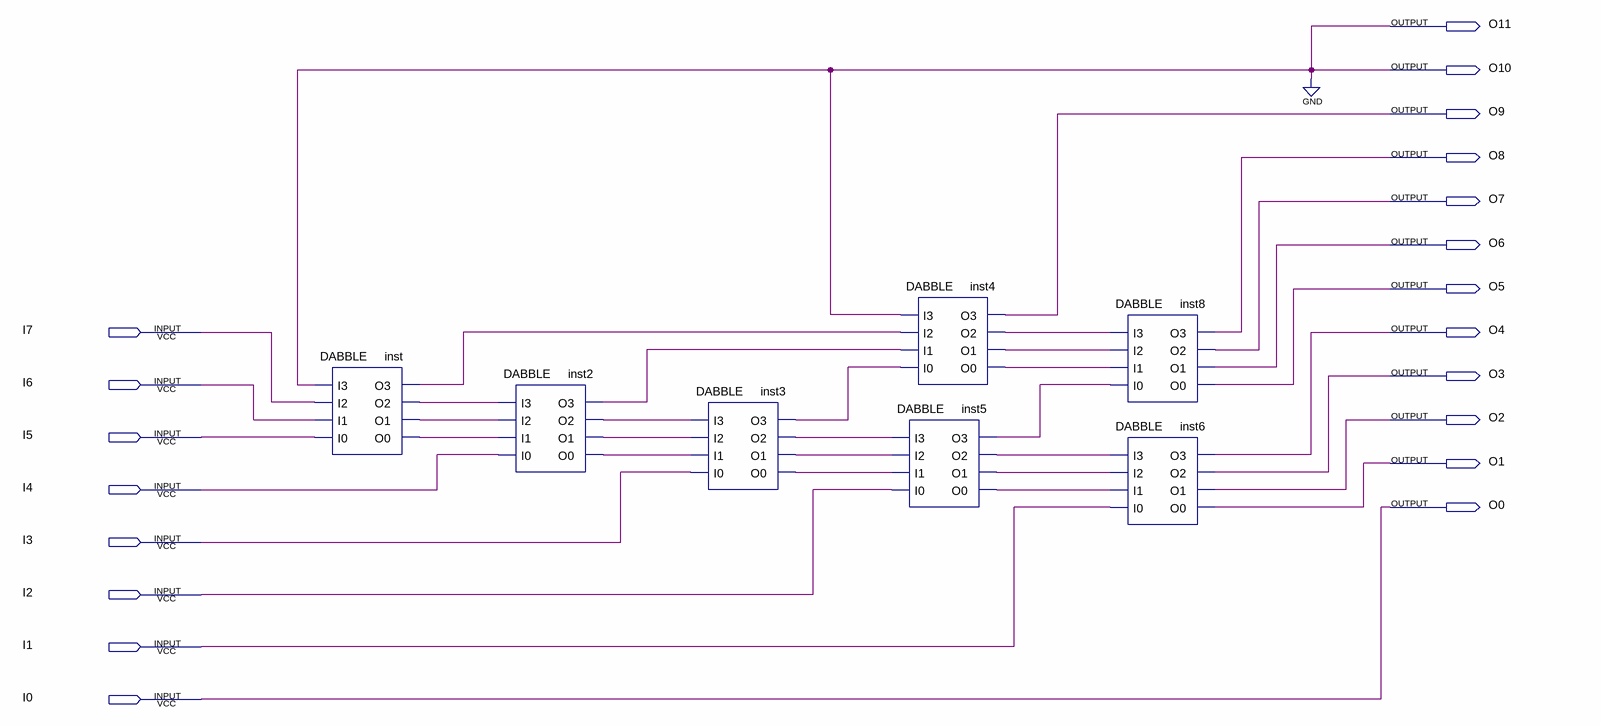
[diagram p0: schematic sheet]
// Quartus schematic DOUBLE_DABBLE.bdf as structural Verilog: 7 symbols, 20 pins
module DOUBLE_DABBLE (
  input  I7,
  input  I6,
  input  I5,
  input  I4,
  input  I3,
  input  I2,
  input  I1,
  input  I0,
  output O11,
  output O10,
  output O9,
  output O8,
  output O7,
  output O6,
  output O5,
  output O4,
  output O3,
  output O2,
  output O1,
  output O0
);

  wire inst2_o0, inst2_o1, inst2_o2, inst2_o3, inst3_o0, inst3_o1, inst3_o2, inst3_o3, inst4_o0, inst4_o1,
       inst4_o2, inst5_o0, inst5_o1, inst5_o2, inst5_o3, inst_o0, inst_o1, inst_o2, inst_o3;

  DABBLE inst (.I3(1'b0), .I2(I7), .I1(I6), .I0(I5), .O3(inst_o3), .O2(inst_o2), .O1(inst_o1), .O0(inst_o0));
  DABBLE inst2 (
    .I3(inst_o2), .I2(inst_o1), .I1(inst_o0), .I0(I4), .O3(inst2_o3), .O2(inst2_o2), .O1(inst2_o1),
    .O0(inst2_o0));
  DABBLE inst3 (
    .I3(inst2_o2), .I2(inst2_o1), .I1(inst2_o0), .I0(I3), .O3(inst3_o3), .O2(inst3_o2), .O1(inst3_o1),
    .O0(inst3_o0));
  DABBLE inst4 (
    .I3(1'b0), .I2(inst_o3), .I1(inst2_o3), .I0(inst3_o3), .O3(O9), .O2(inst4_o2), .O1(inst4_o1),
    .O0(inst4_o0));
  DABBLE inst5 (
    .I3(inst3_o2), .I2(inst3_o1), .I1(inst3_o0), .I0(I2), .O3(inst5_o3), .O2(inst5_o2), .O1(inst5_o1),
    .O0(inst5_o0));
  DABBLE inst8 (.I3(inst4_o2), .I2(inst4_o1), .I1(inst4_o0), .I0(inst5_o3), .O3(O8), .O2(O7), .O1(O6), .O0(O5));
  DABBLE inst6 (.I3(inst5_o2), .I2(inst5_o1), .I1(inst5_o0), .I0(I1), .O3(O4), .O2(O3), .O1(O2), .O0(O1));

  assign O0 = I0;
  assign O10 = 1'b0;
  assign O11 = 1'b0;
endmodule
